# EAGLE schematic v0_1 (EAGLE 6.2)
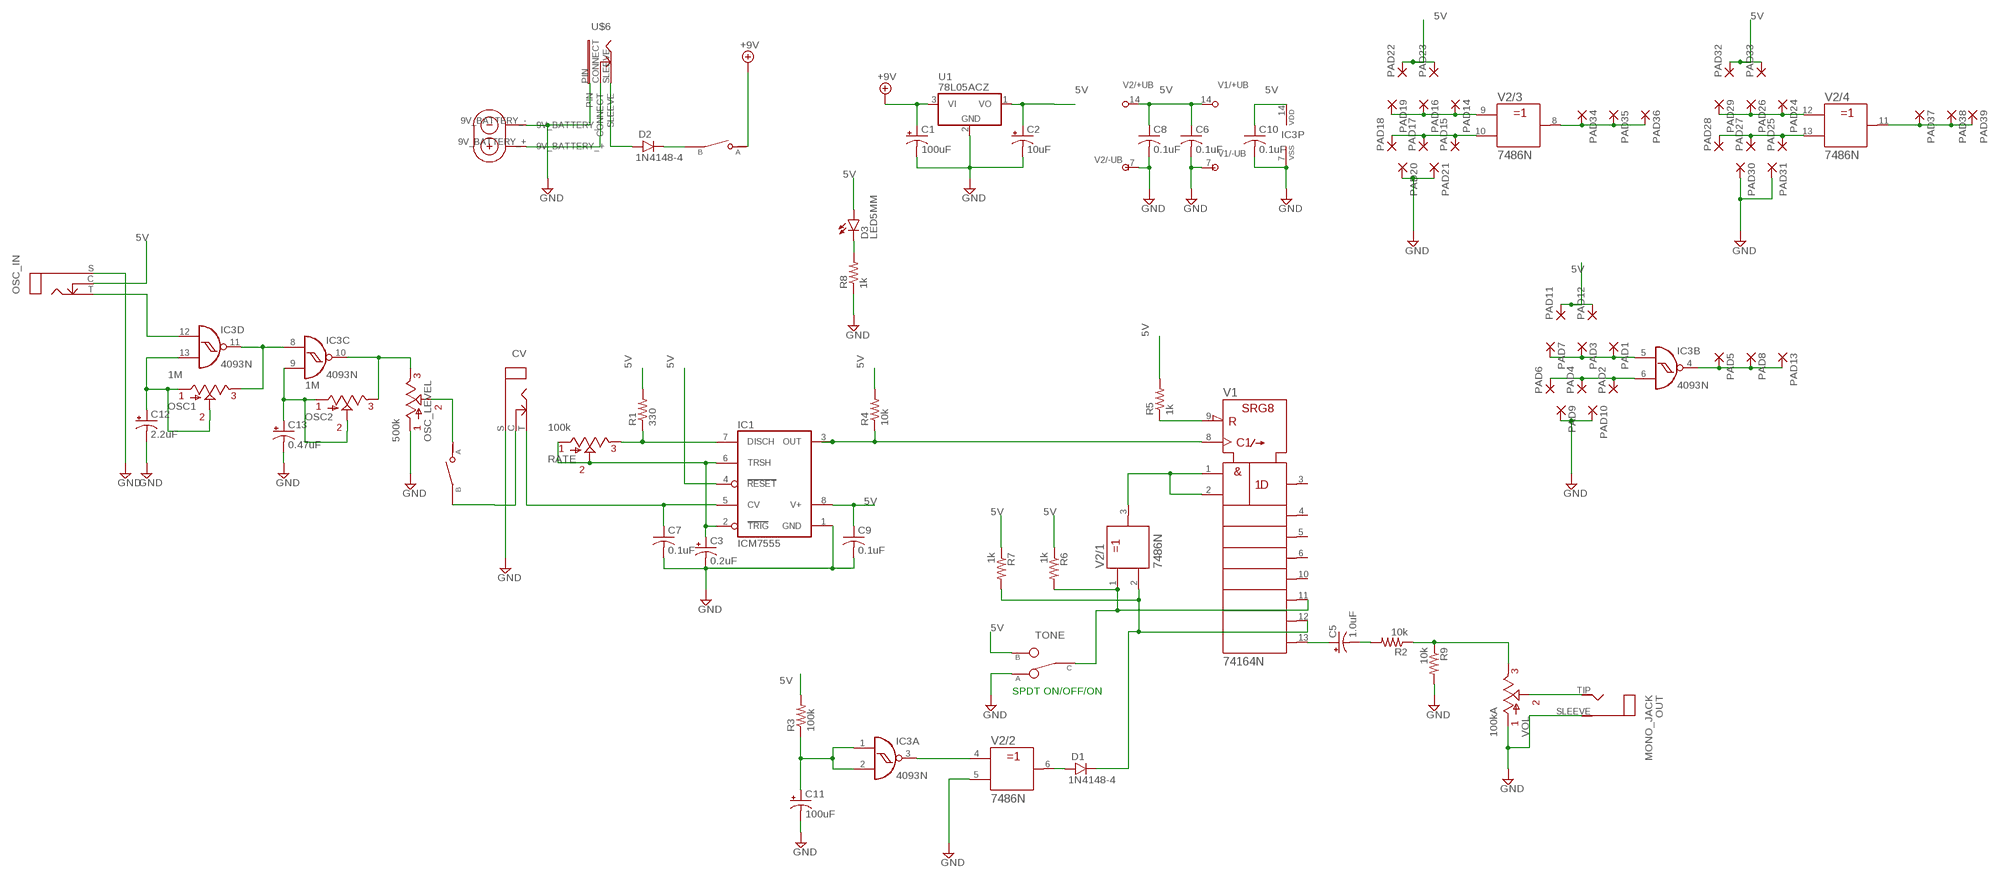
[diagram p0: schematic, sheet 1]

## Parts
C1  100uF  0631  [063_025]
C2  10uF  0631  [063_025]
C3  0.2uF  0631  [063_025]
C5  1.0uF  0631  [063_025]
C6  0.1uF  C-US050-030X075  [C050-030X075]
C7  0.1uF  C-US050-030X075  [C050-030X075]
C8  0.1uF  C-US050-030X075  [C050-030X075]
C9  0.1uF  C-US050-030X075  [C050-030X075]
C10  0.1uF  C-US050-030X075  [C050-030X075]
C11  100uF  0631  [063_025]
C12  2.2uF  0631  [063_025]
C13  0.47uF  0631  [063_025]
CV  MONO_JACK_W_SHUNT  [MONO_JACK_W_SHUNT]
CV+OSC_ON/OFF  SPST_SWITCH  [SPST_TOGGLE_SWITCH]
D1  1N4148-4  [DO35-4]
D2  1N4148-4  [DO35-4]
D3  LED5MM  [LED5MM]
IC1  ICM7555  [DIL08]
IC3  4093N  [DIL14]
ON/OFF  SPST_SWITCH  [SPST_TOGGLE_SWITCH]
OSC1  1M  POT  [POT]
OSC2  1M  POT  [POT]
OSC_IN  MONO_JACK_W_SHUNT  [MONO_JACK_W_SHUNT]
OSC_LEVEL  500k  POT  [POT]
OUT  MONO_JACK  [MONO_JACK]
PAD1  WIREPAD1,6/0,9  [1,6/0,9]
PAD2  WIREPAD1,6/0,9  [1,6/0,9]
PAD3  WIREPAD1,6/0,9  [1,6/0,9]
PAD4  WIREPAD1,6/0,9  [1,6/0,9]
PAD5  WIREPAD1,6/0,9  [1,6/0,9]
PAD6  WIREPAD1,6/0,9  [1,6/0,9]
PAD7  WIREPAD1,6/0,9  [1,6/0,9]
PAD8  WIREPAD1,6/0,9  [1,6/0,9]
PAD9  WIREPAD1,6/0,9  [1,6/0,9]
PAD10  WIREPAD1,6/0,9  [1,6/0,9]
PAD11  WIREPAD1,6/0,9  [1,6/0,9]
PAD12  WIREPAD1,6/0,9  [1,6/0,9]
PAD13  WIREPAD1,6/0,9  [1,6/0,9]
PAD14  WIREPAD1,6/0,9  [1,6/0,9]
PAD15  WIREPAD1,6/0,9  [1,6/0,9]
PAD16  WIREPAD1,6/0,9  [1,6/0,9]
PAD17  WIREPAD1,6/0,9  [1,6/0,9]
PAD18  WIREPAD1,6/0,9  [1,6/0,9]
PAD19  WIREPAD1,6/0,9  [1,6/0,9]
PAD20  WIREPAD1,6/0,9  [1,6/0,9]
PAD21  WIREPAD1,6/0,9  [1,6/0,9]
PAD22  WIREPAD1,6/0,9  [1,6/0,9]
PAD23  WIREPAD1,6/0,9  [1,6/0,9]
PAD24  WIREPAD1,6/0,9  [1,6/0,9]
PAD25  WIREPAD1,6/0,9  [1,6/0,9]
PAD26  WIREPAD1,6/0,9  [1,6/0,9]
PAD27  WIREPAD1,6/0,9  [1,6/0,9]
PAD28  WIREPAD1,6/0,9  [1,6/0,9]
PAD29  WIREPAD1,6/0,9  [1,6/0,9]
PAD30  WIREPAD1,6/0,9  [1,6/0,9]
PAD31  WIREPAD1,6/0,9  [1,6/0,9]
PAD32  WIREPAD1,6/0,9  [1,6/0,9]
PAD33  WIREPAD1,6/0,9  [1,6/0,9]
PAD34  WIREPAD1,6/0,9  [1,6/0,9]
PAD35  WIREPAD1,6/0,9  [1,6/0,9]
PAD36  WIREPAD1,6/0,9  [1,6/0,9]
PAD37  WIREPAD1,6/0,9  [1,6/0,9]
PAD38  WIREPAD1,6/0,9  [1,6/0,9]
PAD39  WIREPAD1,6/0,9  [1,6/0,9]
R1  330  6MM.4  [R0207/4]
R2  10k  6MM.4  [R0207/4]
R3  100k  6MM.4  [R0207/4]
R4  10k  6MM.4  [R0207/4]
R5  1k  6MM.4  [R0207/4]
R6  1k  6MM.4  [R0207/4]
R7  1k  6MM.4  [R0207/4]
R8  1k  6MM.4  [R0207/4]
R9  10k  6MM.4  [R0207/4]
RATE  100k  POT  [POT]
TONE  SPDT_SWITCH  [SPDT_TOGGLE_SWITCH]
U1  78L05ACZ  [TO-92]
U$6  DC_JACK_OFFBOARD  [DC_JACK_OFFBOARD]
U$7  9V_BATTERY_CLIP  [9V_BATTERY]
V1  74164N  [DIL14]
V2  7486N  [DIL14]
VOL  100kA  POT  [POT]

## Nets
5V: C2.+ C6.1 C8.1 C9.1 C10.1 D3.A IC1.4(RESET) IC1.8(V+) IC3.14(P:VDD) OSC_IN.C(CONNECT) PAD11.1(P) PAD12.1(P) PAD22.1(P) PAD23.1(P) PAD32.1(P) PAD33.1(P) R1.2 R3.2 R4.2 R5.2 R6.1 R7.1 TONE.B U1.1(VO) V1.14(+UB) V2.14(/+UB:+UB)
+9V: C1.+ ON/OFF.A U1.3(VI)
GND: C1.- C2.- C3.- C6.2 C7.2 C8.2 C9.2 C10.2 C11.- C12.- C13.- CV.S(SLEEVE) IC1.1(GND) IC3.7(P:VSS) OSC_IN.S(SLEEVE) OSC_LEVEL.1 OUT.SLEEVE PAD9.1(P) PAD10.1(P) PAD20.1(P) PAD21.1(P) PAD30.1(P) PAD31.1(P) R8.1 R9.2 TONE.A U1.2(GND) U$6.PIN U$7.9V_BATTERY_- V1.7(-UB) V2.5(/2:B) V2.7(/-UB:-UB) VOL.1
N$1: C3.+ IC1.2(TRIG) IC1.6(TRSH) RATE.1 RATE.2
N$2: U$6.CONNECT U$7.9V_BATTERY_+
N$3: IC1.3(OUT) R4.1 V1.8(CLK)
N$4: IC1.7(DISCH) R1.1 RATE.3
N$5: R5.1 V1.9(!CLR)
N$6: PAD15.1(P) PAD17.1(P) PAD18.1(P) V2.10(/3:B)
N$7: C7.1 CV.T(TIP) IC1.5(CV)
N$8: V1.1(A) V1.2(B) V2.3(/1:Y)
N$9: R6.2 TONE.C V1.11(QF) V2.1(/1:A)
N$10: D1.C R7.2 V1.12(QG) V2.2(/1:B)
N$11: C5.+ V1.13(QH)
N$12: C5.- R2.2
N$13: R2.1 R9.1 VOL.3
N$14: OUT.TIP VOL.2
N$15: IC3.12(D:I0) OSC_IN.T(TIP)
N$16: C12.+ IC3.13(D:I1) OSC1.1 OSC1.2
N$17: CV+OSC_ON/OFF.B CV.C(CONNECT)
N$18: C11.+ IC3.1(A:I0) IC3.2(A:I1) R3.1
N$19: IC3.3(A:O) V2.4(/2:A)
N$20: D1.A V2.6(/2:Y)
N$21: IC3.8(C:I0) IC3.11(D:O) OSC1.3
N$22: D3.K(C) R8.2
N$23: PAD14.1(P) PAD16.1(P) PAD19.1(P) V2.9(/3:A)
N$24: IC3.4(B:O) PAD5.1(P) PAD8.1(P) PAD13.1(P)
N$25: IC3.6(B:I1) PAD2.1(P) PAD4.1(P) PAD6.1(P)
N$26: IC3.5(B:I0) PAD1.1(P) PAD3.1(P) PAD7.1(P)
N$27: PAD34.1(P) PAD35.1(P) PAD36.1(P) V2.8(/3:Y)
N$28: PAD37.1(P) PAD38.1(P) PAD39.1(P) V2.11(/4:Y)
N$29: PAD25.1(P) PAD27.1(P) PAD28.1(P) V2.13(/4:B)
N$30: PAD24.1(P) PAD26.1(P) PAD29.1(P) V2.12(/4:A)
N$31: CV+OSC_ON/OFF.A OSC_LEVEL.2
N$32: C13.+ IC3.9(C:I1) OSC2.1 OSC2.2
N$34: D2.A U$6.SLEEVE
N$35: D2.C ON/OFF.B
N$36: IC3.10(C:O) OSC2.3 OSC_LEVEL.3
Unconnected: V1.3(QA) V1.4(QB) V1.5(QC) V1.6(QD) V1.10(QE)

## Notes on the sheet
- SPDT ON/OFF/ON

## Library data of the parts
C1-C3 C5 C11-C13 = gm-caps-electro-pol:063: 33 - 220uF Xicon values at Mouser.com 10V: 220uF; 16V: 100uF; 25V: 100uF; 50V: 33uF
C6-C10 = resistor:C-US: CAPACITOR, American symbol
CV OSC_IN = 00_steve:MONO_JACK_W_SHUNT
CV+OSC_ON/OFF ON/OFF = 00_steve:SPST_SWITCH: SPST Switch Part No.: M101 Source: (http://www.led-switch.com)
D1 D2 = gm-diodes:1N4148: Fast Switching Diode DO-35 glass case a.k.a. 1N914
D3 = gm-diodes:LED
IC1 = maxim:ICM7555: TIMER
IC3 = 40xx:4093: Quad 2-input NAND schmitt trigger
OSC1 OSC2 OSC_LEVEL RATE VOL = 00_steve:POT
OUT = 00_steve:MONO_JACK
PAD1-PAD39 = wirepad:WIREPAD: Wire PAD connect wire on PCB
R1-R9 = gm-resistors:6MM: 6mm Resistors Leads spaced 1-6 holes apart for 0.1" perfboard. Suitable for 1/4 watt resistors.
TONE = 00_steve:SPDT_SWITCH: SPDT Switch Part No.: M102 Source: (http://www.led-switch.com)
U1 = 00_steve:78L05ACZ
U$6 = 00_steve:DC_JACK_OFFBOARD
U$7 = 00_steve:9V_BATTERY_CLIP
V1 = 74ttl-din:74*164: 8-bit parallel out SHIFT REGISTER
V2 = 74ttl-din:74*86: Quad 2-input EXCLUSIV-OR gate